# EAGLE design Adafruit_tftlcd8bit (EAGLE 5.01)
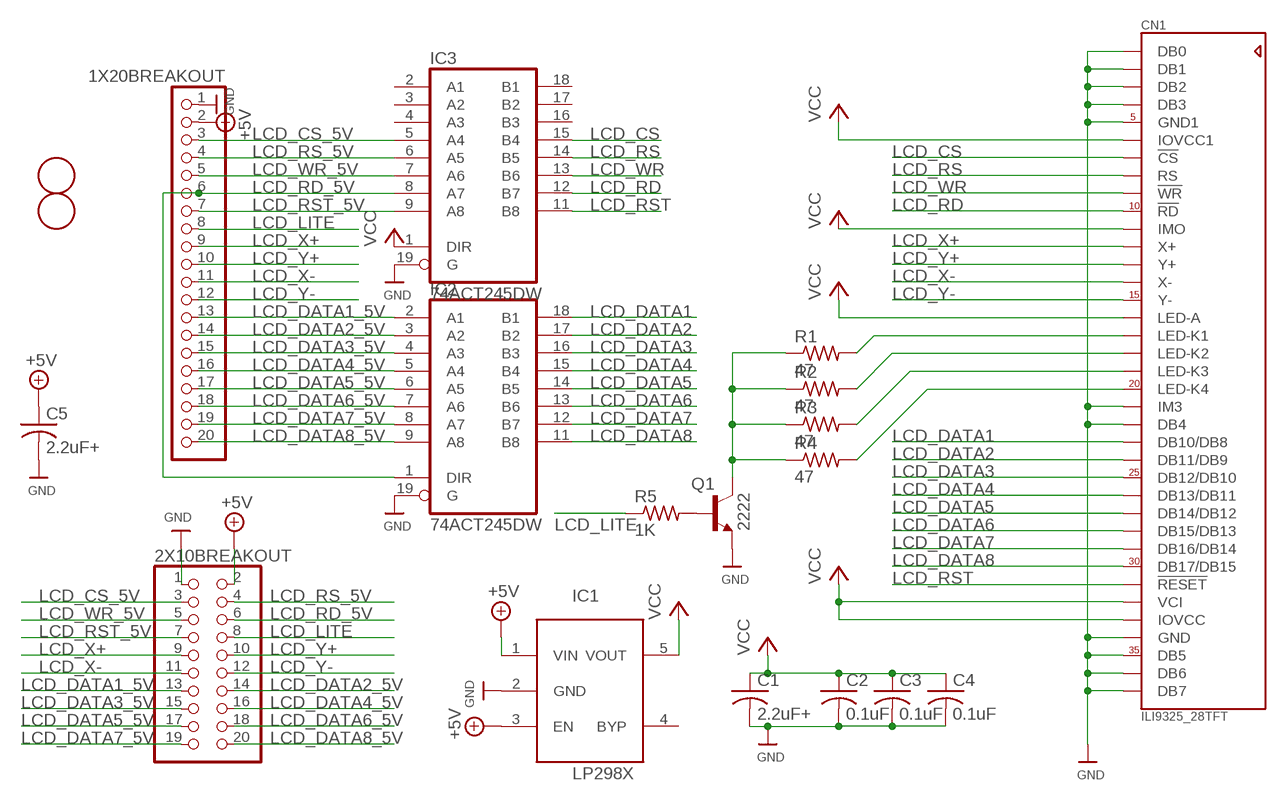
[diagram p0: schematic, sheet 1]

## Parts
1X20BREAKOUT  PINHD-1X20  [1X20]
2X10BREAKOUT  PINHD-2X10  [2X10]
C1  2.2uF+  C-USC0805K  [C0805K]
C2  0.1uF  C-USC0805K  [C0805K]
C3  0.1uF  C-USC0805K  [C0805K]
C4  0.1uF  C-USC0805K  [C0805K]
C5  2.2uF+  C-USC0805K  [C0805K]
CN1  ILI9325_28TFT  ILI9325_LCD1.0MM  [ILI9325_28INCH_TS]
IC1  LP298XS  [SOT23-5L]
IC2  74ACT245DW  [SO20W]
IC3  74ACT245DW  [SO20W]
Q1  2222  MMBT2222ALT1-NPN-SOT23-BEC  [SOT23-BEC]
R1  47  R-US_R0805  [R0805]
R2  47  R-US_R0805  [R0805]
R3  47  R-US_R0805  [R0805]
R4  47  R-US_R0805  [R0805]
R5  1K  R-US_R0805  [R0805]
U$9  FIDUCIAL  [FIDUCIAL_1MM]
U$11  FIDUCIAL  [FIDUCIAL_1MM]

## Nets
+5V: 1X20BREAKOUT.2 2X10BREAKOUT.2 C5.1 IC1.1(VIN) IC1.3(EN)
GND: 1X20BREAKOUT.1 2X10BREAKOUT.1 C1.2 C2.2 C3.2 C4.2 C5.2 CN1.1(DB0) CN1.2(DB1) CN1.3(DB2) CN1.4(DB3) CN1.5(GND1) CN1.21(IM3) CN1.22(DB4) CN1.34(GND) CN1.35(DB5) CN1.36(DB6) CN1.37(DB7) IC1.2(GND) IC2.19(G) IC3.19(G) Q1.E
LCD_CS: CN1.7(!CS) IC3.15(B4)
LCD_CS_5V: 1X20BREAKOUT.3 2X10BREAKOUT.3 IC3.5(A4)
LCD_DATA1: CN1.23(DB10/DB8) IC2.18(B1)
LCD_DATA1_5V: 1X20BREAKOUT.13 2X10BREAKOUT.13 IC2.2(A1)
LCD_DATA2: CN1.24(DB11/DB9) IC2.17(B2)
LCD_DATA2_5V: 1X20BREAKOUT.14 2X10BREAKOUT.14 IC2.3(A2)
LCD_DATA3: CN1.25(DB12/DB10) IC2.16(B3)
LCD_DATA3_5V: 1X20BREAKOUT.15 2X10BREAKOUT.15 IC2.4(A3)
LCD_DATA4: CN1.26(DB13/DB11) IC2.15(B4)
LCD_DATA4_5V: 1X20BREAKOUT.16 2X10BREAKOUT.16 IC2.5(A4)
LCD_DATA5: CN1.27(DB14/DB12) IC2.14(B5)
LCD_DATA5_5V: 1X20BREAKOUT.17 2X10BREAKOUT.17 IC2.6(A5)
LCD_DATA6: CN1.28(DB15/DB13) IC2.13(B6)
LCD_DATA6_5V: 1X20BREAKOUT.18 2X10BREAKOUT.18 IC2.7(A6)
LCD_DATA7: CN1.29(DB16/DB14) IC2.12(B7)
LCD_DATA7_5V: 1X20BREAKOUT.19 2X10BREAKOUT.19 IC2.8(A7)
LCD_DATA8: CN1.30(DB17/DB15) IC2.11(B8)
LCD_DATA8_5V: 1X20BREAKOUT.20 2X10BREAKOUT.20 IC2.9(A8)
LCD_LITE: 1X20BREAKOUT.8 2X10BREAKOUT.8 R5.1
LCD_RD: CN1.10(!RD) IC3.12(B7)
LCD_RD_5V: 1X20BREAKOUT.6 2X10BREAKOUT.6 IC2.1(DIR) IC3.8(A7)
LCD_RS: CN1.8(RS) IC3.14(B5)
LCD_RS_5V: 1X20BREAKOUT.4 2X10BREAKOUT.4 IC3.6(A5)
LCD_RST: CN1.31(!RESET) IC3.11(B8)
LCD_RST_5V: 1X20BREAKOUT.7 2X10BREAKOUT.7 IC3.9(A8)
LCD_WR: CN1.9(!WR) IC3.13(B6)
LCD_WR_5V: 1X20BREAKOUT.5 2X10BREAKOUT.5 IC3.7(A6)
LCD_X+: 1X20BREAKOUT.9 2X10BREAKOUT.9 CN1.12(X+)
LCD_X-: 1X20BREAKOUT.11 2X10BREAKOUT.11 CN1.14(X-)
LCD_Y+: 1X20BREAKOUT.10 2X10BREAKOUT.10 CN1.13(Y+)
LCD_Y-: 1X20BREAKOUT.12 2X10BREAKOUT.12 CN1.15(Y-)
N$1: CN1.20(LED-K4) R4.2
N$2: CN1.17(LED-K1) R1.2
N$3: CN1.18(LED-K2) R2.2
N$4: CN1.19(LED-K3) R3.2
N$5: Q1.C R1.1 R2.1 R3.1 R4.1
N$16: Q1.B R5.2
VCC: C1.1 C2.1 C3.1 C4.1 CN1.6(IOVCC1) CN1.11(IMO) CN1.16(LED-A) CN1.32(VCI) CN1.33(IOVCC) IC1.5(VOUT) IC3.1(DIR)
Unconnected: IC1.4(BYP) IC3.2(A1) IC3.3(A2) IC3.4(A3) IC3.16(B3) IC3.17(B2) IC3.18(B1)

## Power pins joined to a net without a drawn wire
GND: IC2.10(GND) IC3.10(GND)
VCC: IC2.20(VCC) IC3.20(VCC)

## Library data of the parts
1X20BREAKOUT = pinhead:PINHD-1X20: PIN HEADER
2X10BREAKOUT = pinhead:PINHD-2X10: PIN HEADER
C1-C5 = adafruit:C-US: CAPACITOR, American symbol
CN1 = adafruit:ILI9325_LCD: 2.8" ILI9325-based TFT LCD w/Integrated Touch Screen
IC1 = adafruit:LP298X
IC2 IC3 = 74xx-eu:74*245: Octal BUS TRANSCEIVER, 3-state
Q1 = transistor-neu-to92:*-NPN-: NPN Transistror
R1-R5 = rcl:R-US_: RESISTOR, American symbol
U$9 U$11 = adafruit:FIDUCIAL: For use by pick and place machines to calibrate the vision/machine, 1mm By microbuilder.eu

## Board
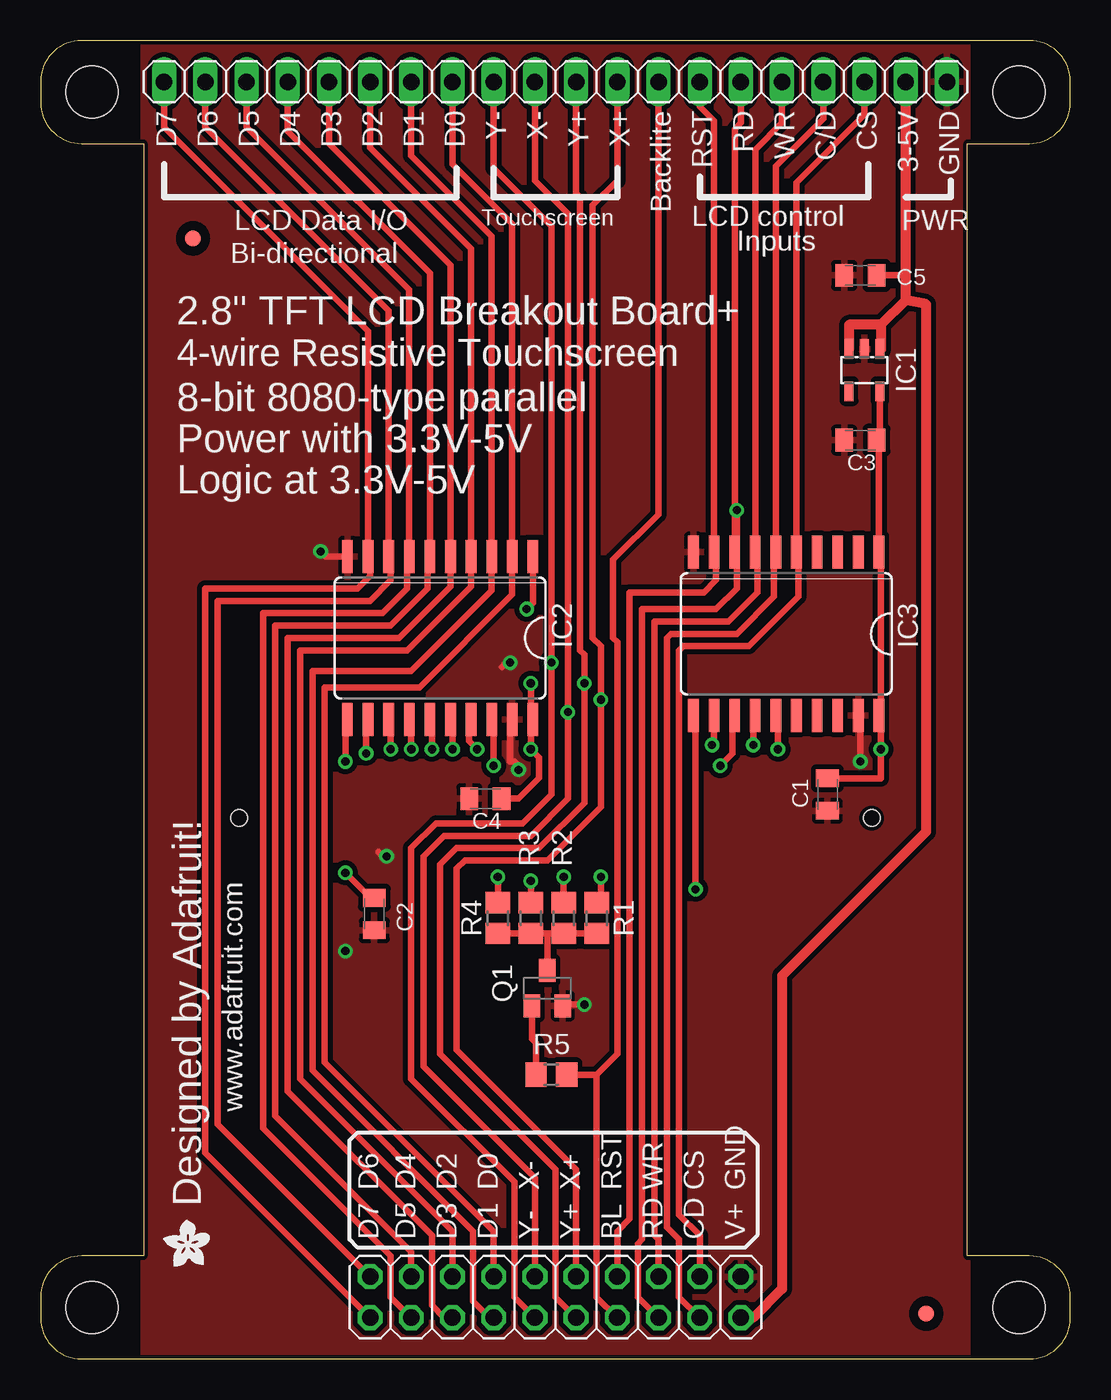
[diagram p1: board, top side]
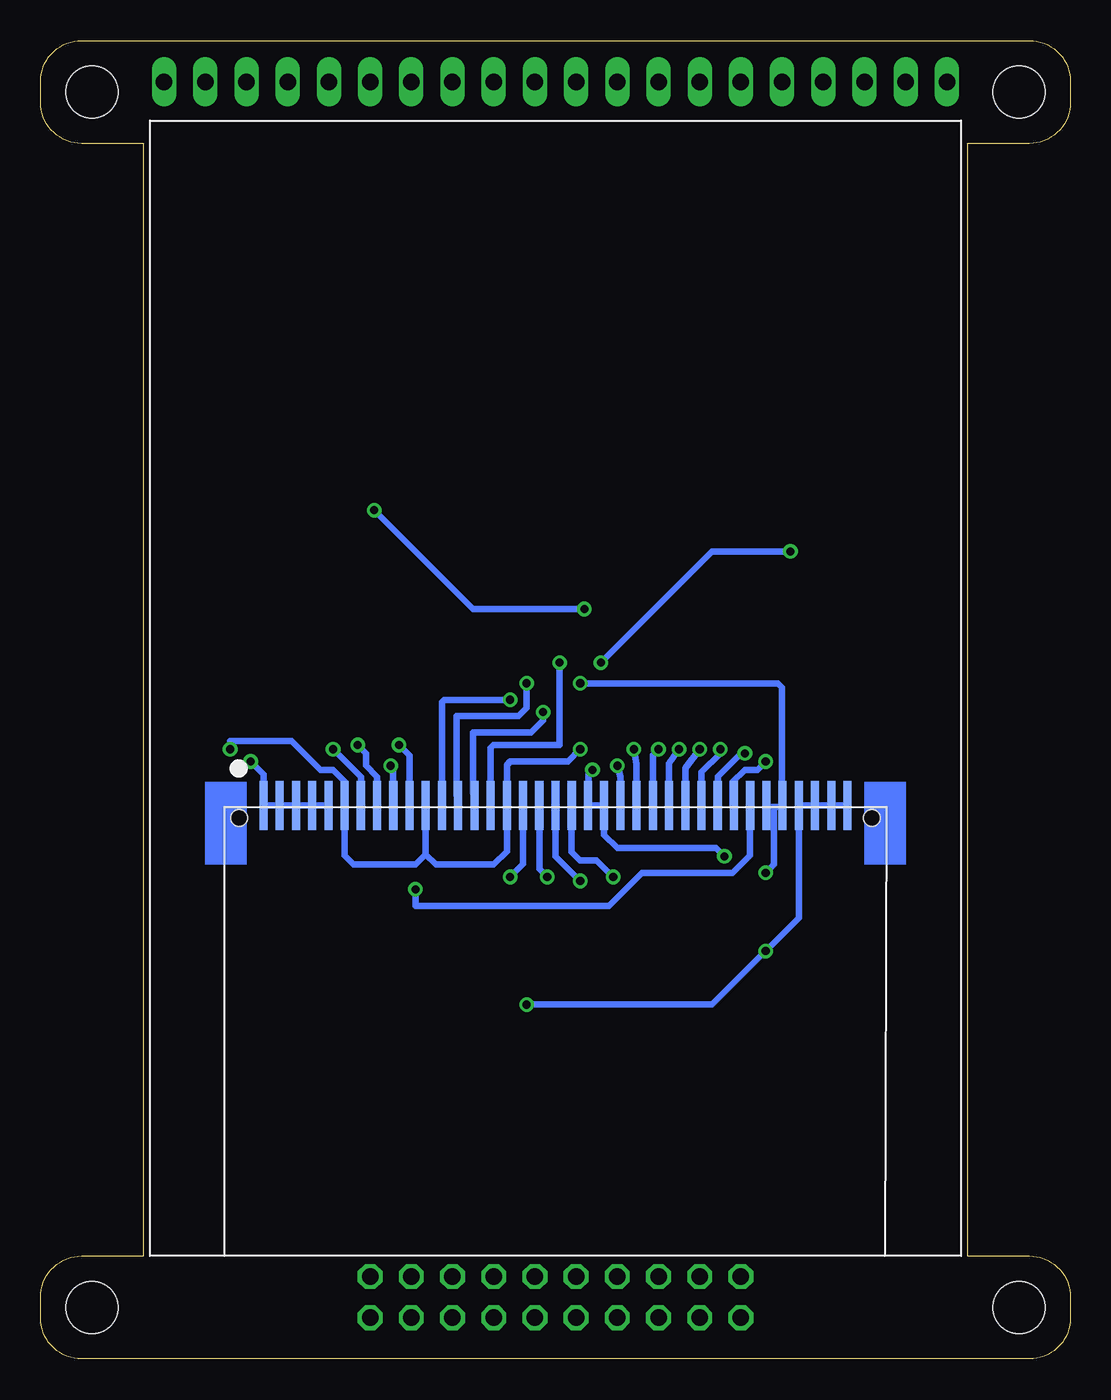
[diagram p2: board, bottom side, seen from below]

Size 63.5 x 81.28 mm. Coordinates in mm from the lower left corner, seen from the top.
Outline: 60.96,0 arc90 63.5,2.54 63.5,3.81 arc90 60.96,6.35 57.15,6.35 57.15,74.93 60.96,74.93 arc90 63.5,77.47 63.5,78.74 arc90 60.96,81.28 2.54,81.28 arc90 0,78.74 0,77.47 arc90 2.54,74.93 6.35,74.93 6.35,6.35 2.54,6.35 arc90 0,3.81 0,2.54 arc90 2.54,0 60.96,0
Copper layers (1*16): Top 0.035mm / dielectric 1.5mm / Bottom 0.035mm
Design rules "default *": minimum track width 16mil, minimum drill 19mil, track to track 12mil, track to pad 12mil, pad to pad 12mil, via to via 12mil, smd to smd 8mil, copper to edge 10mil, drill to drill 8mil, minimum pad ring 10mil, minimum via ring 8mil, stop-mask expansion 4mil, vias tented up to drill 20mil, thermal gap 10mil
Holes 3.2 mm at 3.18,78.11 3.18,3.17 60.33,3.17 60.33,78.11

### Footprints (pad centres in the part's own frame; a part is rotated, then mirrored left to right if it is on the bottom)
1X20 = drill 1.016 long: 1 -24.13,0; 2 -21.59,0; 3 -19.05,0; 4 -16.51,0; 5 -13.97,0; 6 -11.43,0; 7 -8.89,0; 8 -6.35,0; 9 -3.81,0; 10 -1.27,0; 11 1.27,0; 12 3.81,0; 13 6.35,0; 14 8.89,0; 15 11.43,0; 16 13.97,0; 17 16.51,0; 18 19.05,0; 19 21.59,0; 20 24.13,0
2X10 = drill 1.016 octagon: 1 -11.43,-1.27; 2 -11.43,1.27; 3 -8.89,-1.27; 4 -8.89,1.27; 5 -6.35,-1.27; 6 -6.35,1.27; 7 -3.81,-1.27; 8 -3.81,1.27; 9 -1.27,-1.27; 10 -1.27,1.27; 11 1.27,-1.27; 12 1.27,1.27; 13 3.81,-1.27; 14 3.81,1.27; 15 6.35,-1.27; 16 6.35,1.27; 17 8.89,-1.27; 18 8.89,1.27; 19 11.43,-1.27; 20 11.43,1.27
C0805K = smd 1.1 x 1.4: 1 -1,0; 2 1,0
ILI9325_28INCH_TS = smd 0.5 x 3: 1 -18,27.77; 2 -17,27.77; 3 -16,27.77; 4 -15,27.77; 5 -14,27.77; 6 -13,27.77; 7 -12,27.77; 8 -11,27.77; 9 -10,27.77; 10 -9,27.77; 11 -8,27.77; 12 -7,27.77; 13 -6,27.77; 14 -5,27.77; 15 -4,27.77; 16 -3,27.77; 17 -2,27.77; 18 -1,27.77; 19 0,27.77; 20 1,27.77; 21 2,27.77; 22 3,27.77; 23 4,27.77; 24 5,27.77; 25 6,27.77; 26 7,27.77; 27 8,27.77; 28 9,27.77; 29 10,27.77; 30 11,27.77; 31 12,27.77; 32 13,27.77; 33 14,27.77; 34 15,27.77; 35 16,27.77; 36 17,27.77; 37 18,27.77 | hole 1: -19.5,27; 19.5,27
SOT23-5L = smd 0.55 x 1.2: 1 -0.95,-1.3; 2 0,-1.3; 3 0.95,-1.3; 4 0.95,1.3; 5 -0.95,1.3
SO20W = smd 0.66 x 2.032: 1 -5.715,-5.029; 2 -4.445,-5.029; 3 -3.175,-5.029; 4 -1.905,-5.029; 5 -0.635,-5.029; 6 0.635,-5.029; 7 1.905,-5.029; 8 3.175,-5.029; 9 4.445,-5.029; 10 5.715,-5.029; 11 5.715,5.029; 12 4.445,5.029; 13 3.175,5.029; 14 1.905,5.029; 15 0.635,5.029; 16 -0.635,5.029; 17 -1.905,5.029; 18 -3.175,5.029; 19 -4.445,5.029; 20 -5.715,5.029
SOT23-BEC = smd 1 x 1.4: B -0.95,-1.1; C 0,1.1; E 0.95,-1.1
R0805 = smd 1.3 x 1.5: 1 -0.95,0; 2 0.95,0
FIDUCIAL_1MM = smd 1 x 1: 1 0,0

### Placement (x,y rotation side)
1X20BREAKOUT  31.75,78.74 180 top
2X10BREAKOUT  31.75,3.81 180 top
C1  48.51,34.8 270 top
C2  20.57,27.43 270 top
C3  50.55,56.64 180 top
C4  27.43,34.54 180 top
C5  50.55,66.8 180 top
CN1  31.75,6.35 0 bottom
IC1  50.8,60.96 180 top
IC2  24.64,44.45 180 top
IC3  45.97,44.7 180 top
Q1  31.24,22.86 0 top
R1  34.29,27.18 90 top
R2  32.26,27.18 90 top
R3  30.23,27.18 90 top
R4  28.19,27.18 90 top
R5  31.5,17.53 180 top
U$3  [ADAFRUIT200MIL]  8.89,7.11 0 top
U$9  54.61,2.79 0 top
U$11  9.4,69.09 0 top

### Tracks (layer width: path | path; a pad name or v marks a point on that pad's centre or on a via)
+5V
  Top 0.406: 51.82,62.23 51.75,62.23 IC1.1 | 53.34,66.8 C5.1
  Top 0.61: IC1.3 49.85,63.75 51.82,63.75 | 51.82,63.75 51.82,62.23 | 53.34,65.28 53.34,66.8 1X20BREAKOUT.2 | 53.34,65.28 51.82,63.75 | 2X10BREAKOUT.2 43.94,2.54 45.72,4.32 45.72,23.62 54.61,32.51 54.61,65.02 53.34,65.28
GND  (via drill 0.5)
  Top 0.406: IC2.19 29.03,39.37 28.96,39.37 28.96,36.83 29.21,36.83 29.46,36.58 v29.46,36.32 | IC2.10 17.58,49.48 v17.27,49.78 | v28.96,42.93 28.7,42.93 28.45,42.67 | Q1.E 32.28,21.84 v33.53,21.84 | IC3.19 50.5,39.67 50.55,39.62 v50.55,36.83 | v21.34,30.99 21.08,30.99 20.83,31.24
  Bottom 0.406: CN1.37 CN1.36 CN1.35 CN1.34 16.75,27.18 18.78,25.15 v18.8,25.15 22.1,21.84 v33.53,21.84 | v17.27,49.78 22.1,49.78 v28.96,42.93 | 47.75,34.04 arc-90 47.75,34.04 CN1.3 | 47.75,34.04 arc-90 47.84,34.12 CN1.2 CN1.1 | CN1.5 46.65,34.12 arc-90 46.74,34.04 arc90 46.75,34.05 CN1.4 CN1.3 | CN1.3 47.75,34.04 | CN1.1 49.78,34.12 49.78,34.04 | CN1.1 49.75,36.03 v50.55,36.83 | v29.46,36.32 29.72,36.32 29.72,34.12 CN1.21 CN1.22 28.75,32.31 27.94,31.5 21.84,31.5 v21.34,30.99
  pour Top: 6.35,81.28 6.35,0 57.15,0 57.15,81.28
LCD_CS  (via drill 0.5)
  Top 0.406: IC3.15 45.47,39.55 v45.47,37.59
  Bottom 0.406: CN1.7 43.75,35.88 v45.47,37.59
LCD_CS_5V
  Top 0.406: 50.8,79.25 1X20BREAKOUT.3 50.8,76.71 46.61,72.52 IC3.5 46.66,49.78 46.74,49.78 46.74,46.99 43.69,43.94 39.62,43.94 39.37,43.69 39.37,8.89 40.64,7.62 2X10BREAKOUT.3
LCD_DATA1  (via drill 0.5)
  Top 0.406: IC2.18 27.81,39.5 27.94,39.62 v27.94,36.58
  Bottom 0.406: CN1.23 27.75,35.88 v27.94,36.58
LCD_DATA1_5V
  Top 0.406: 1X20BREAKOUT.13 25.4,73.66 29.08,69.98 IC2.2 29.08,47.12 23.37,41.4 17.53,41.4 17.53,18.29 27.94,7.87 2X10BREAKOUT.13 27.94,4.83
LCD_DATA2  (via drill 0.5)
  Top 0.406: IC2.17 26.49,39.37 26.42,39.37 26.42,38.1 v26.92,37.59
  Bottom 0.406: CN1.24 26.75,36.66 v26.92,37.59
LCD_DATA2_5V
  Top 0.406: 1X20BREAKOUT.14 22.61,78.74 22.86,78.49 22.86,74.17 27.81,69.22 IC2.3 27.81,47.37 22.86,42.42 16.76,42.42 16.76,17.78 26.67,7.87 26.67,3.56 27.69,2.54 2X10BREAKOUT.14
LCD_DATA3  (via drill 0.5)
  Top 0.406: IC2.16 25.35,39.42 25.4,39.37 v25.4,37.59
  Bottom 0.406: CN1.25 25.75,37.24 v25.4,37.59
LCD_DATA3_5V
  Top 0.406: 1X20BREAKOUT.15 20.57,78.74 20.32,78.49 20.32,74.68 26.54,68.45 IC2.4 26.54,47.62 22.61,43.69 16,43.69 16,17.27 25.4,7.87 2X10BREAKOUT.15 25.4,4.83
LCD_DATA4  (via drill 0.5)
  Top 0.406: IC2.15 24.08,39.42 24.13,39.37 v24.13,37.59
  Bottom 0.406: CN1.26 24.75,36.72 v24.13,37.59
LCD_DATA4_5V
  Top 0.406: 1X20BREAKOUT.16 17.53,78.74 17.78,78.49 17.78,74.93 25.27,67.44 IC2.5 25.27,47.62 22.1,44.45 15.24,44.45 15.24,16.51 24.13,7.62 24.13,3.3 24.89,2.54 2X10BREAKOUT.16 25.65,2.54
LCD_DATA5  (via drill 0.5)
  Top 0.406: IC2.14 22.68,39.37 22.86,39.37 v22.86,37.59
  Bottom 0.406: CN1.27 23.75,36.45 v22.86,37.59
LCD_DATA5_5V
  Top 0.406: 1X20BREAKOUT.17 15.24,75.69 24,66.93 IC2.6 23.93,49.48 23.88,49.53 23.88,47.5 21.59,45.21 14.48,45.21 14.48,14.99 22.86,6.6 2X10BREAKOUT.17
LCD_DATA6  (via drill 0.5)
  Top 0.406: IC2.13 21.46,39.5 21.59,39.37 v21.59,37.59
  Bottom 0.406: CN1.28 22.75,36.18 21.59,37.34 v21.59,37.59
LCD_DATA6_5V
  Top 0.406: 1X20BREAKOUT.18 12.7,75.95 22.73,65.91 IC2.7 22.68,49.53 22.61,49.53 22.61,47.5 21.08,45.97 13.72,45.97 13.72,14.22 21.59,6.35 21.59,3.81 2X10BREAKOUT.18
LCD_DATA7  (via drill 0.5)
  Top 0.406: IC2.12 20.12,39.42 20.07,39.37 v20.07,37.34
  Bottom 0.406: CN1.29 21.75,35.91 20.32,37.34 v20.07,37.34
LCD_DATA7_5V
  Top 0.406: 1X20BREAKOUT.19 10.16,75.95 21.46,64.64 IC2.8 21.59,49.35 21.59,48.01 20.32,46.74 10.92,46.74 10.92,14.48 2X10BREAKOUT.19
LCD_DATA8  (via drill 0.5)
  Top 0.406: IC2.11 18.92,39.5 18.8,39.62 v18.8,36.83
  Bottom 0.406: 20.75,33.86 CN1.30 20.83,34.2 20.83,35.56 20.07,36.32 19.3,36.32 v18.8,36.83
LCD_DATA8_5V
  Top 0.406: 1X20BREAKOUT.20 7.37,78.74 7.62,78.49 7.62,75.95 20.19,63.37 IC2.9 20.24,49.53 20.32,49.53 20.32,48.26 19.56,47.5 10.16,47.5 10.16,12.7 2X10BREAKOUT.20
LCD_LITE
  Top 0.406: 34.26,17.49 34.29,17.53 R5.1 | 34.26,17.49 34.29,17.46 34.29,3.81 2X10BREAKOUT.8 | 1X20BREAKOUT.8 38.1,52.07 35.31,49.28 35.31,44.45 35.56,44.2 35.56,18.8 34.26,17.49
LCD_RD  (via drill 0.5)
  Top 0.406: IC3.12 41.53,37.97 v41.4,37.85
  Bottom 0.406: CN1.10 40.75,37.19 v41.4,37.85
LCD_RD_5V  (via drill 0.5)
  Top 0.406: 43.18,78.99 1X20BREAKOUT.6 43.18,76.2 42.8,75.82 IC3.8 42.88,49.73 42.93,49.78 | 2X10BREAKOUT.6 36.83,3.81 36.83,7.11 37.08,7.37 37.08,46.23 41.66,46.23 42.93,47.5 42.93,49.78 | IC2.1 30.35,46.61 v29.97,46.23 | v42.93,52.32 42.93,49.78
  Bottom 0.406: v29.97,46.23 36.83,46.23 v42.93,52.32
LCD_RS  (via drill 0.5)
  Top 0.406: 43.94,39.8 43.94,39.88 | 43.94,39.8 IC3.14 | v43.94,37.85 43.94,39.8
  Bottom 0.406: CN1.8 42.75,35.89 43.43,36.58 43.43,37.34 v43.94,37.85
LCD_RS_5V
  Top 0.406: 1X20BREAKOUT.4 48.01,78.74 48.26,78.49 48.26,76.45 45.34,73.53 IC3.6 45.34,49.66 45.21,49.53 45.21,46.99 42.93,44.7 38.86,44.7 38.61,44.45 38.61,8.13 39.37,7.37 39.37,3.81 2X10BREAKOUT.4
LCD_RST  (via drill 0.5)
  Top 0.406: IC3.11 40.21,39.62 40.39,39.62 v40.39,28.96
  Bottom 0.406: CN1.31 19.75,31.05 20.83,29.97 26.42,29.97 28.45,27.94 40.39,27.94 v40.39,28.96
LCD_RST_5V
  Top 0.406: 1X20BREAKOUT.7 40.64,77.22 41.53,76.33 IC3.9 41.66,49.86 41.66,48.01 40.89,47.24 36.32,47.24 36.32,8.64 35.56,7.87 2X10BREAKOUT.7
LCD_WR  (via drill 0.5)
  Top 0.406: IC3.13 42.67,39.55 42.67,37.34 v41.91,36.58
  Bottom 0.406: CN1.9 41.75,36.67 v41.91,36.58
LCD_WR_5V
  Top 0.406: 45.47,78.99 1X20BREAKOUT.5 45.72,76.2 44.07,74.55 IC3.7 44.07,49.66 44.2,49.53 44.2,47.24 42.42,45.47 37.85,45.47 37.85,7.62 38.1,7.37 2X10BREAKOUT.5
LCD_X+  (via drill 0.5)
  Top 0.406: 1X20BREAKOUT.9 35.56,72.64 34.04,71.12 34.04,44.45 34.54,43.94 v34.54,40.64 34.54,34.04 31.24,30.73 26.16,30.73 25.65,30.23 25.65,19.05 33.02,11.68 2X10BREAKOUT.9
  Bottom 0.406: CN1.12 38.75,40.5 38.61,40.64 v34.54,40.64
LCD_X-  (via drill 0.5)
  Top 0.406: 1X20BREAKOUT.11 30.48,72.64 32.51,70.61 v32.51,39.88 32.51,34.54 30.23,32.26 24.89,32.26 23.62,30.99 23.62,18.03 30.48,11.18 2X10BREAKOUT.11
  Bottom 0.406: CN1.14 36.83,34.97 36.83,38.61 33.27,38.61 32.51,39.37 v32.51,39.88
LCD_Y+  (via drill 0.5)
  Top 0.406: 1X20BREAKOUT.10 33.02,71.88 33.27,71.63 33.27,43.69 33.53,43.43 v33.53,41.66 33.53,34.29 30.73,31.5 25.65,31.5 24.64,30.48 24.64,18.8 31.75,11.68 31.75,3.81 2X10BREAKOUT.10
  Bottom 0.406: v33.53,41.66 33.53,40.13 34.04,39.62 37.85,39.62 37.85,34.8 CN1.13
LCD_Y-  (via drill 0.5)
  Top 0.406: 1X20BREAKOUT.12 27.94,73.41 31.5,69.85 v31.5,42.93 31.5,34.8 29.72,33.02 24.38,33.02 22.86,31.5 22.86,17.27 29.21,10.92 29.21,3.81 2X10BREAKOUT.12
  Bottom 0.406: CN1.15 35.75,37.66 35.56,37.85 31.5,37.85 v31.5,42.93
N$1  (via drill 0.5)
  Top 0.406: 28.19,27.94 R4.2 v28.19,29.72
  Bottom 0.406: CN1.20 30.75,31.26 30.23,30.73 29.21,30.73 v28.19,29.72
N$2  (via drill 0.5)
  Top 0.406: R1.2 34.29,28.19 34.54,28.45 v34.54,29.72
  Bottom 0.406: CN1.17 33.75,30.51 v34.54,29.72
N$3  (via drill 0.5)
  Top 0.406: v32.26,29.72 R2.2
  Bottom 0.406: CN1.18 32.75,30.21 v32.26,29.72
N$4  (via drill 0.5)
  Top 0.406: 30.29,28.13 30.48,27.94 | 30.29,28.13 R3.2 | v30.23,29.46 30.23,28.19 30.29,28.13
  Bottom 0.406: CN1.19 31.75,30.99 v30.23,29.46
N$5
  Top 0.406: R4.1 30.16,26.23 30.23,26.16 R3.1 31.24,26.23 | 31.24,26.23 32.19,26.23 32.26,26.16 R2.1 33.97,26.23 34.04,26.16 34.1,26.23 R1.1 | 31.24,26.23 Q1.C
N$16
  Top 0.406: R5.2 30.55,19.49 30.29,19.75 Q1.B
VCC  (via drill 0.5)
  Top 0.406: 51.82,40.13 51.82,49.61 IC3.1 51.69,56.26 51.31,56.64 C3.1 51.56,56.64 51.75,56.83 IC1.5 | 30.23,39.37 30.3,39.37 IC2.20 30.35,39.5 | 30.23,39.37 v30.23,41.66 | C2.1 20.34,28.43 v18.8,29.97 | 51.82,40.13 51.82,39.8 IC3.20 | 51.82,40.13 v51.82,37.59 51.82,35.8 C1.1 | 30.35,39.5 30.48,39.62 | 30.23,39.37 v30.23,37.59 30.73,37.08 30.73,35.81 29.46,34.54 C4.1 | 30.35,39.5 30.23,39.37
  Bottom 0.406: CN1.16 34.75,31.29 35.56,30.48 39.12,30.48 39.75,31.11 | 39.75,31.11 CN1.11 | 39.75,31.11 40.39,30.48 44.2,30.48 44.75,31.03 CN1.6 44.75,35.61 45.47,36.32 46.23,36.32 48.01,38.1 51.82,38.1 v51.82,37.59 | v30.23,41.66 18.03,41.66 17.78,41.4 17.78,35.34 CN1.33 17.78,34.09 17.78,34.04 18.29,34.04 | CN1.16 34.75,33.83 34.8,33.78 | v18.8,29.97 18.29,30.48 18.29,34.04 | 18.29,34.04 18.67,34.04 CN1.32 | CN1.16 34.75,36.62 34.54,36.83 30.99,36.83 v30.23,37.59

### Text on the board
tPlace: D7 | D6 | D5 | D4 | D3 | D2 | D1 | D0 | Y- | X- | Y+ | X+ | Backlite | RST | RD | WR | C/D | CS | 3-5V | GND | LCD Data I/O | Touchscreen | LCD control | PWR | Inputs | Bi-directional | 2.8" TFT LCD Breakout Board+ | 4-wire Resistive Touchscreen | 8-bit 8080-type parallel | Power with 3.3V-5V | Logic at 3.3V-5V | www.adafruit.com | D6 | D4 | D2 | D0 | X- | X+ | RST | WR | CS | GND | Designed by Adafruit! | D7 | D5 | D3 | D1 | Y- | Y+ | BL | RD | CD | V+